# EAGLE design conv (EAGLE 6.1)
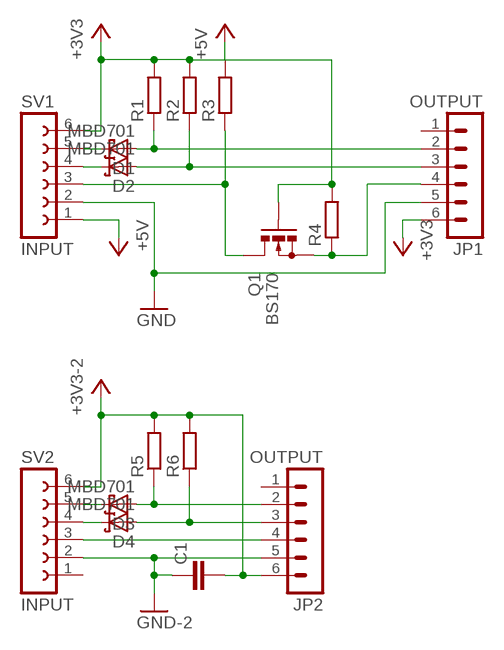
[diagram p0: schematic, sheet 1]

## Parts
C1  C-EU025-025X050  [C025-025X050]
D1  MBD701  [TO92H]
D2  MBD701  [TO92H]
D3  MBD701  [TO92H]
D4  MBD701  [TO92H]
JP1  OUTPUT  MA06-1  [MA06-1]
JP2  OUTPUT  MA06-1  [MA06-1]
Q1  BS170  [SOT54E]
R1  R-EU_0207/2V  [0207/2V]
R2  R-EU_0207/5V  [0207/5V]
R3  R-EU_0207/5V  [0207/5V]
R4  R-EU_0207/2V  [0207/2V]
R5  R-EU_0207/2V  [0207/2V]
R6  R-EU_0207/5V  [0207/5V]
SV1  INPUT  FE06W  [FE06W]
SV2  INPUT  FE06W  [FE06W]

## Nets
+3V3: C1.2 JP1.6 JP2.6 Q1.G R1.2 R2.2 R4.2 R5.2 R6.2 SV1.6 SV2.6 ; supply symbol labelled +3V3-2
+5V: SV1.1
+5V-1: R3.2 ; supply symbol labelled +5V
GND: C1.1 JP1.5 JP2.5 SV1.2 SV2.2 ; supply symbol labelled GND-2
H-RST: D1.2(C) SV1.5
H-RST1: D3.2(C) SV2.5
H-RX: Q1.D R3.1 SV1.3
H-TX: D2.2(C) SV1.4
H-TX1: D4.2(C) SV2.4
L-RST: D1.1(A) JP1.2 R1.1
L-RST1: D3.1(A) JP2.2 R5.1
L-RX: JP1.4 Q1.S R4.1
L-RX1: JP2.4 SV2.3
L-TX: D2.1(A) JP1.3 R2.1
L-TX1: D4.1(A) JP2.3 R6.1
Unconnected: JP1.1 JP2.1 SV2.1

## Library data of the parts
C1 = rcl:C-EU: CAPACITOR, European symbol
D1-D4 = diode:MBD701: UHF DIODE
JP1 JP2 = con-lstb:MA06-1: PIN HEADER; OC_FARNELL: unknown; OC_NEWARK: unknown
Q1 = transistor-small-signal:BS170: N-CHANNEL MOS FET
R1-R6 = rcl:R-EU_: RESISTOR, European symbol
SV1 SV2 = con-lsta:FE06W: FEMALE HEADER; OC_FARNELL: unknown; OC_NEWARK: unknown

## Board
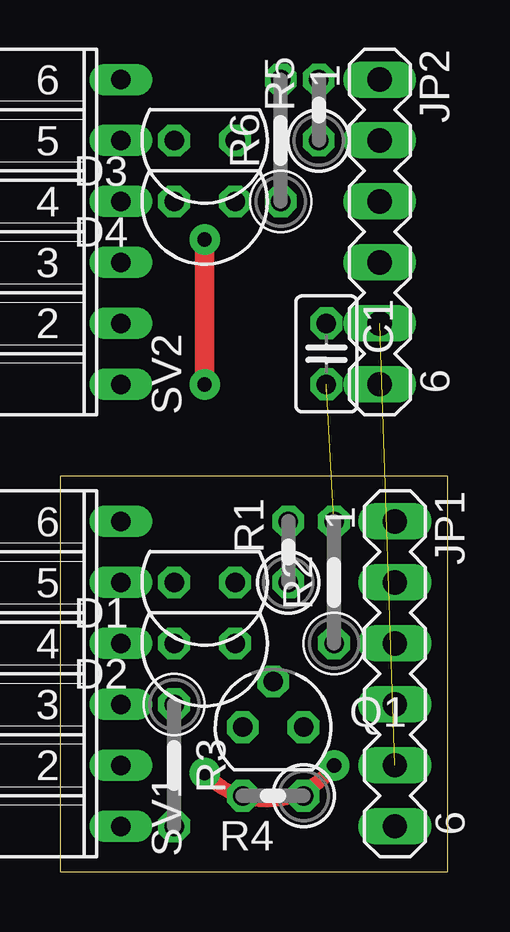
[diagram p1: board, top side]
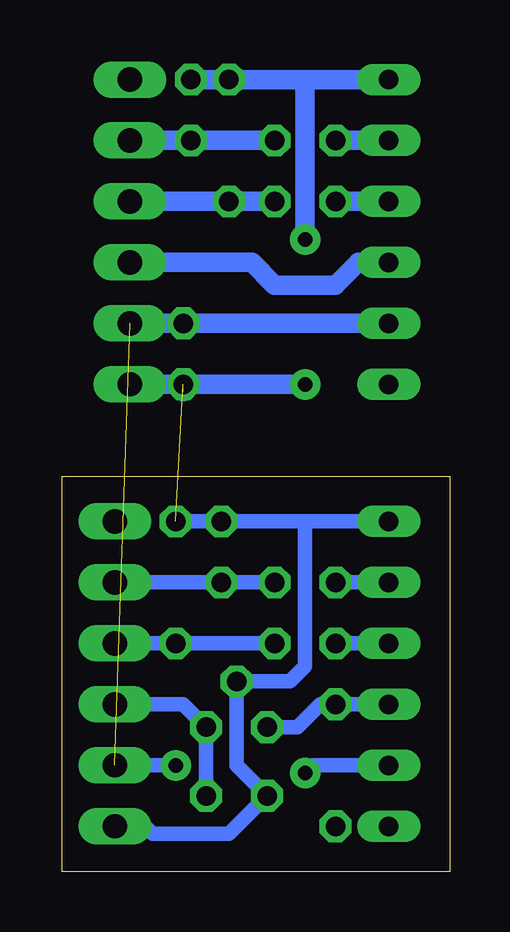
[diagram p2: board, bottom side, seen from below]

Size 16.17 x 16.5 mm. Coordinates in mm from the lower left corner, seen from the top.
Outline: 0,0 16.17,0 16.17,16.5 0,16.5 0,0
Copper layers (1*16): Top 0.035mm / dielectric 1.5mm / Bottom 0.035mm
Design rules: minimum track width 10mil, minimum drill 24mil, track to track 8mil, track to pad 8mil, pad to pad 8mil, via to via 8mil, smd to smd 8mil, copper to edge 40mil, drill to drill 8mil, minimum pad ring 10mil, minimum via ring 8mil, stop-mask expansion 4mil, vias tented up to drill 0mil, thermal gap 10mil

### Footprints (pad centres in the part's own frame; a part is rotated, then mirrored left to right if it is on the bottom)
C025-025X050 = drill 0.813 octagon: 1 -1.27,0; 2 1.27,0
TO92H = drill 0.813 octagon: 1 -1.27,0; 2 1.27,0
MA06-1 = drill 1.016 long: 1 -6.35,0; 2 -3.81,0; 3 -1.27,0; 4 1.27,0; 5 3.81,0; 6 6.35,0
SOT54E = drill 0.813 octagon: D -1.27,0; G 0,1.905; S 1.27,0
0207/2V = drill 0.813 octagon: 1 -1.27,0; 2 1.27,0
0207/5V = drill 0.813 octagon: 1 -2.54,0; 2 2.54,0
FE06W = drill 0.813 long: 1 -6.35,0; 2 -3.81,0; 3 -1.27,0; 4 1.27,0; 5 3.81,0; 6 6.35,0

### Placement (x,y rotation side)
C1  11.11,21.59 270 top  (outside the outline)
D1  6.03,12.06 180 top
D2  6.03,9.53 180 top
D3  6.03,30.48 180 top  (outside the outline)
D4  6.03,27.94 180 top  (outside the outline)
JP1  13.97,8.26 270 top
JP2  13.34,26.67 270 top  (outside the outline)
Q1  8.89,6.03 0 top
R1  9.53,13.34 90 top
R2  11.43,12.06 90 top
R3  4.76,4.45 270 top
R4  8.89,3.17 180 top
R5  10.79,31.75 90 top  (outside the outline)
R6  9.21,30.48 90 top  (outside the outline)
SV1  2.54,8.26 90 top
SV2  2.54,26.67 90 top  (outside the outline)

### Tracks (layer width: path | path; a pad name or v marks a point on that pad's centre or on a via)
+3V3  (via drill 0.6 pad 1.27)  (2 unrouted)
  Top 0.813: v6.03,26.35 v6.03,20.32
  Bottom 0.61: SV1.6 6.03,14.61 | 6.03,14.61 R1.2 R2.2 | 6.03,14.61 6.03,8.57 6.67,7.94 Q1.G 8.89,4.45 R4.2 9.21,1.59 12.38,1.59 12.7,1.91 JP1.6
  Bottom 0.813: SV2.6 6.03,33.02 | 6.03,33.02 R6.2 R5.2 | 6.03,33.02 v6.03,26.35 | C1.2 JP2.6 | v6.03,20.32 10.79,20.32 11.11,20
GND  (via drill 0.6 pad 1.27)  (1 unrouted)
  Top 0.61: v6.03,4.13 arc102 v11.43,4.45
  Bottom 0.61: SV1.2 5.71,4.45 v6.03,4.13 | v11.43,4.45 JP1.5
  Bottom 0.813: SV2.2 C1.1 JP2.5
H-RST
  Bottom 0.61: SV1.5 D1.2
H-RST1
  Bottom 0.813: SV2.5 D3.2
H-RX
  Bottom 0.61: SV1.3 R3.1 5.4,6.99 6.35,6.03 Q1.D
H-TX
  Bottom 0.61: SV1.4 D2.2
H-TX1
  Bottom 0.813: SV2.4 D4.2
L-RST
  Bottom 0.61: D1.1 R1.1 JP1.2
L-RST1
  Bottom 0.813: D3.1 R5.1 JP2.2
L-RX
  Bottom 0.61: R4.1 Q1.S 11.11,6.99 JP1.4
L-RX1
  Bottom 0.813: SV2.3 3.81,25.4 4.76,24.45 7.3,24.45 8.26,25.4 JP2.4
L-TX
  Bottom 0.61: D2.1 R2.1 JP1.3
L-TX1
  Bottom 0.813: D4.1 R6.1 JP2.3